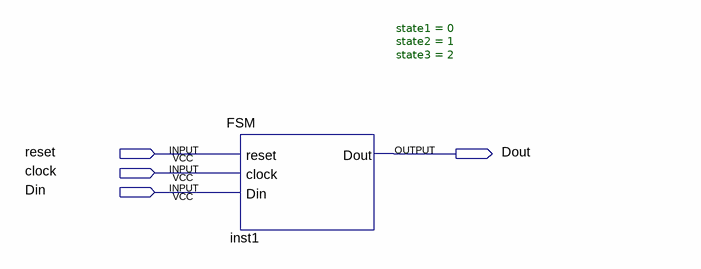
[diagram p0: schematic sheet]
// Quartus schematic FSM.bdf as structural Verilog: 1 symbols, 4 pins
module FSM (
  input  reset,
  input  clock,
  input  Din,
  output Dout
);

  FSM #(.state1(0), .state2(1), .state3(2)) inst1 (.reset(reset), .clock(clock), .Din(Din), .Dout(Dout));
endmodule
